# EAGLE design LowTemp_board_1 (EAGLE 6.4)
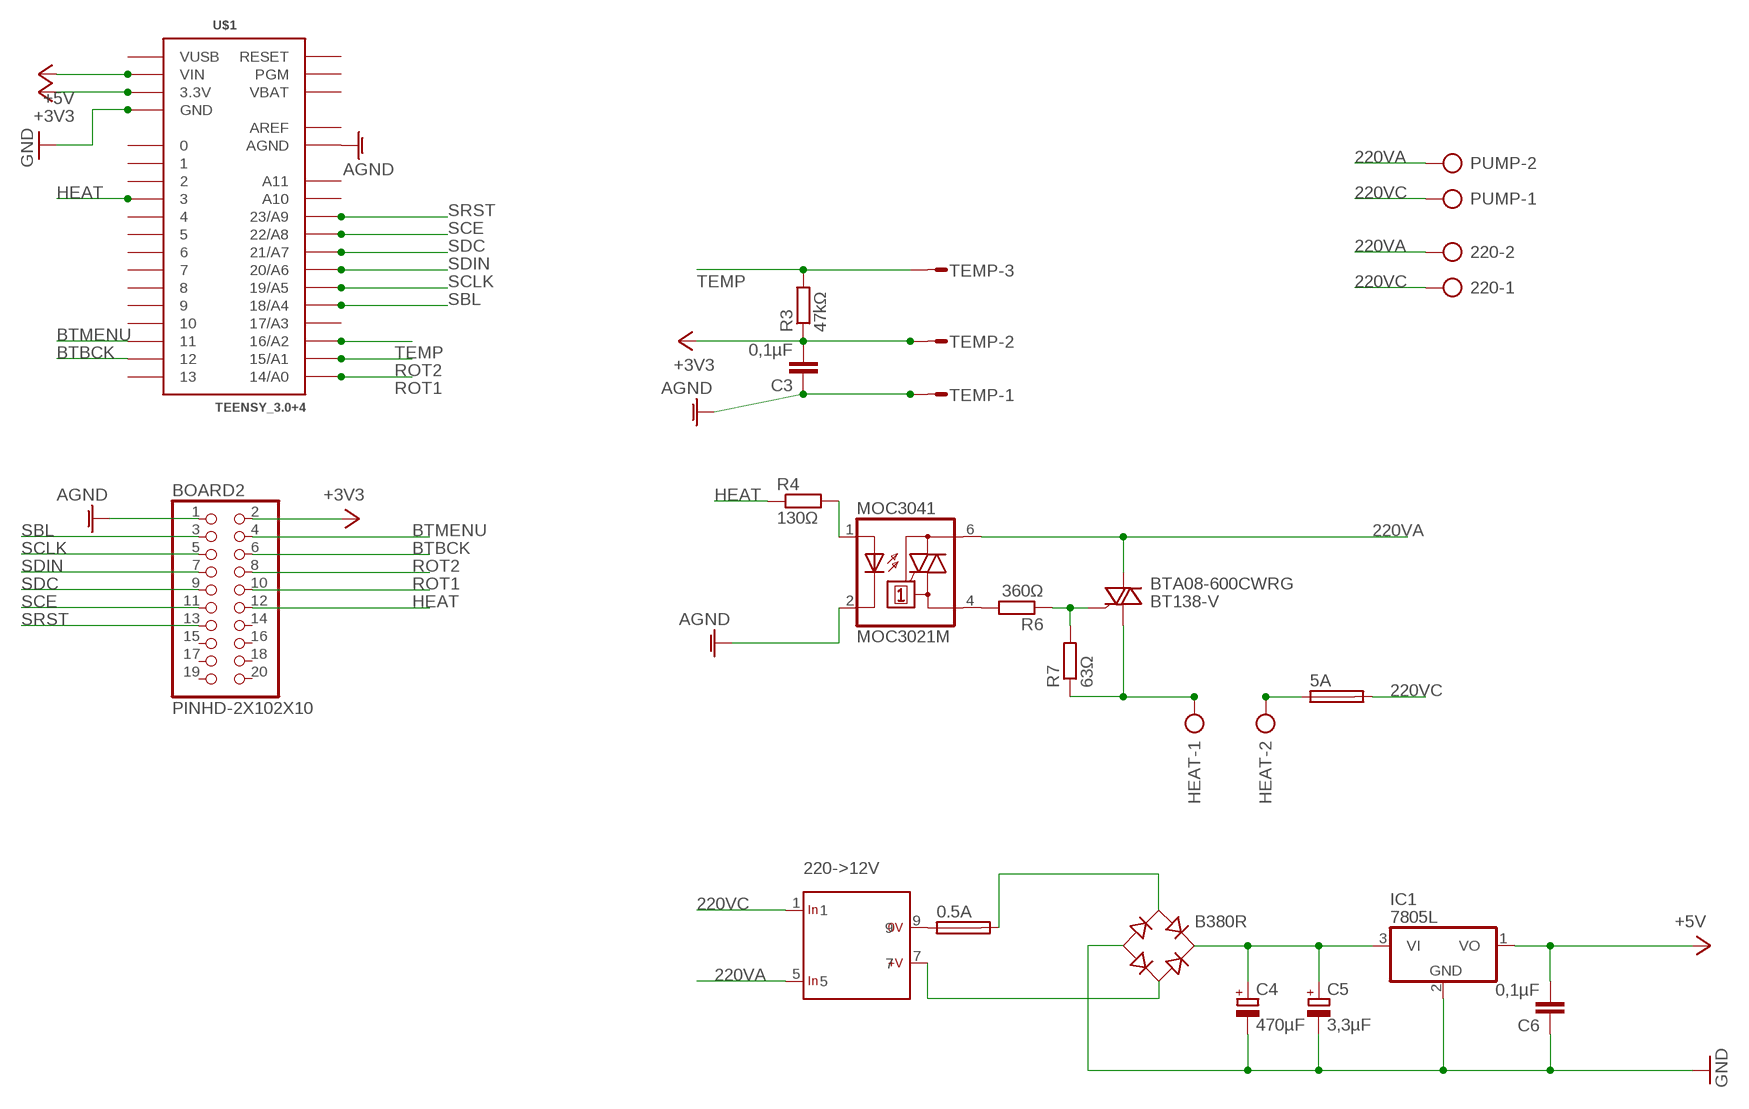
[diagram p0: schematic, sheet 1]

## Parts
0.5A  SH22,5A  [SH22,5A]
5A  SH22,5A  [SH22,5A]
220  AK500/2-H  [AK500/2-H]
220->12V  SINGLE  [1]
B380R  RB1A  [RB1A]
BOARD2  PINHD-2X102X10  [2X10]
BTA08-600CWRG  BT138-V  [TO220BV]
C3  0,1µF  C-EU050-025X075  [C050-025X075]
C4  470µF  CPOL-EUE5-8.5  [E5-8,5]
C5  3,3µF  CPOL-EUTT2D4  [TT2D4]
C6  0,1µF  C-EU050-025X075  [C050-025X075]
HEAT  AK500/2-H  [AK500/2-H]
IC1  7805L  [TO92]
MOC3041  MOC3021M  [DIL06]
PUMP  AK500/2-H  [AK500/2-H]
R3  47kΩ  R-EU_0207/7  [0207/7]
R4  130Ω  R-EU_0207/7  [0207/7]
R6  360Ω  R-EU_0207/7  [0207/7]
R7  63Ω  R-EU_0207/7  [0207/7]
TEMP  S03P  [S03P]
U$1  TEENSY_3.0+4  [TEENSY_3.0+4]

## Nets
220VA: 220->12V.5 220.2 BTA08-600CWRG.T2(A2) MOC3041.6(A2) PUMP.2
220VC: 5A.2 220->12V.1 220.1 PUMP.1
+3V3: BOARD2.2 C3.2 R3.1 TEMP.2 U$1.3.3V U$1.3.3V1(3.3V)
+5V: C6.2 IC1.1(VO) U$1.VIN
AGND: BOARD2.1 C3.1 MOC3041.2(C) TEMP.1 U$1.AGND
BTBCK: BOARD2.6 U$1.12
BTMENU: BOARD2.4 U$1.11
GND: B380R.- C4.- C5.- C6.1 IC1.2(GND) U$1.GND U$1.GND1(GND)
HEAT: BOARD2.12 R4.1 U$1.3
N$3: MOC3041.1(A) R4.2
N$5: MOC3041.4(A1) R6.2
N$6: BTA08-600CWRG.G R6.1 R7.2
N$7: 0.5A.1 220->12V.9
N$8: BTA08-600CWRG.T1(A1) HEAT.1 R7.1
N$9: 5A.1 HEAT.2
N$10: 220->12V.7 B380R.AC2
N$11: 0.5A.2 B380R.AC1
N$13: B380R.+ C4.+ C5.+ IC1.3(VI)
ROT1: BOARD2.10 U$1.14/A0
ROT2: BOARD2.8 U$1.15/A1
SBL: BOARD2.3 U$1.18/A4
SCE: BOARD2.11 U$1.22/A8
SCLK: BOARD2.5 U$1.19/A5
SDC: BOARD2.9 U$1.21/A7
SDIN: BOARD2.7 U$1.20/A6
SRST: BOARD2.13 U$1.23/A9
TEMP: R3.2 TEMP.3 U$1.16/A2
Unconnected: BOARD2.14 BOARD2.15 BOARD2.16 BOARD2.17 BOARD2.18 BOARD2.19 BOARD2.20 U$1.0 U$1.1 U$1.2 U$1.4 U$1.5 U$1.6 U$1.7 U$1.8 U$1.9 U$1.10 U$1.13 U$1.17/A3 U$1.A10 U$1.A11 U$1.PGM U$1.RESET

## Power pins joined to a net without a drawn wire
AREF: U$1.AREF
VBAT: U$1.VBAT
VUSB: U$1.VUSB

## Library data of the parts
0.5A 5A = fuse:SH22,5A: FUSE HOLDER grid 22,5mm, isolated cap OGN0031 8201, Schurter (Buerklin); MPN: 0031.7701.11; OC_FARNELL: unknown; OC_NEWARK: 04F1224
220 HEAT PUMP = con-ptr500:AK500/2-H: CONNECTOR Aug. 2004 / PTR Meßtechnik: Die Bezeichnung der Serie AK505 wurde geändert. Es handelt sich hierbei um AK500 in horizontaler Ausführung.; OC_FARNELL: unknown; OC_NEWARK: unknown
220->12V = myrra:SINGLE: One Output Input voltage range: 85 to 265 V AC or 85 to 370 V DC Input frequency: 47 to 440 Hz Output voltage accuracy (full load ): ± 2% Line output voltage variation: ± 0.3% Load output voltage variation: ± 0.5% Temperature range: -25 - TA (°C) No load input power: < 200mW regulated: Reference Output Current Power Efficiency Ta Volts mA Watts % °C 47121 3.3 750 2.5 65 +70 47122 5 550 2.75 68 +70 47123 9 270 2.5 72 +70 47124 12 210 2.5 74 +70 47125 15 170 2.5 75 +70 47126 24 110 2.5 77 +70 47151 3.3 1350 4.2 65 +50 47152 5 900 4.5 68 +50 47153 9 550 5 72 +50 47154 12 420 5 75 +50 47155 15 320 5 76 +50 47156 24 220 5 79 +50 non regulated: Reference Output Current Power Efficiency Ta Volts mA Watts % °C 47114 12 200 2.4 74 +70 47133 9 360 3.2 73 +70 47134 12 270 3.2 75 +70 47136 24 130 3.2 80 +70 47163 9 560 5* 73 +50 47164 12 420 5* 75 +50 47166 24 210 5* 80 +50 * Nota: Power up to 5.4W is possible with input voltage > 97 V AC Source: http://www.myrra.com
B380R = rectifier:RB1A: RECTIFIER 1 A
BOARD2 = adafruit:PINHD-2X10
BTA08-600CWRG = triac:BT138: TRIAC Source: http://www.semiconductors.philips.com BT138_SERIES_2.pdf
C3 C6 = resistor:C-EU: CAPACITOR, European symbol
C4 C5 = resistor:CPOL-EU: POLARIZED CAPACITOR, European symbol
IC1 = linear:78*: Positive VOLTAGE REGULATOR Source: http://cache.national.com/ds/LM/LM78L05.pdf http://www.fairchildsemi.com/ds/LM/LM7805.pdf
MOC3041 = optocoupler:MOC30*M: RANDOM-PHASE OPTOISOLATORS TRIAC DRIVER OUTPUT Source: http://www.fairchildsemi.com MOC3020-M.pdf; MF: FAIRCHILD SEMICONDUCTOR; MPN: MOC3021-M; OC_FARNELL: 1021365; OC_NEWARK: 95B7895
R3 R4 R6 R7 = resistor:R-EU_: RESISTOR, European symbol
TEMP = con-amp-mt:S03P: AMP MT CONNECTOR; OC_FARNELL: unknown; OC_NEWARK: unknown
U$1 = Teensy3.0:TEENSY_3.0+4: Teensy 3.0 board, showing all pins that are easily acessible. See 'AllAnalogPins" and 'AllPins' packages for additional pin holes, as needed. The 'Basic' package has fewer pins.

## Board
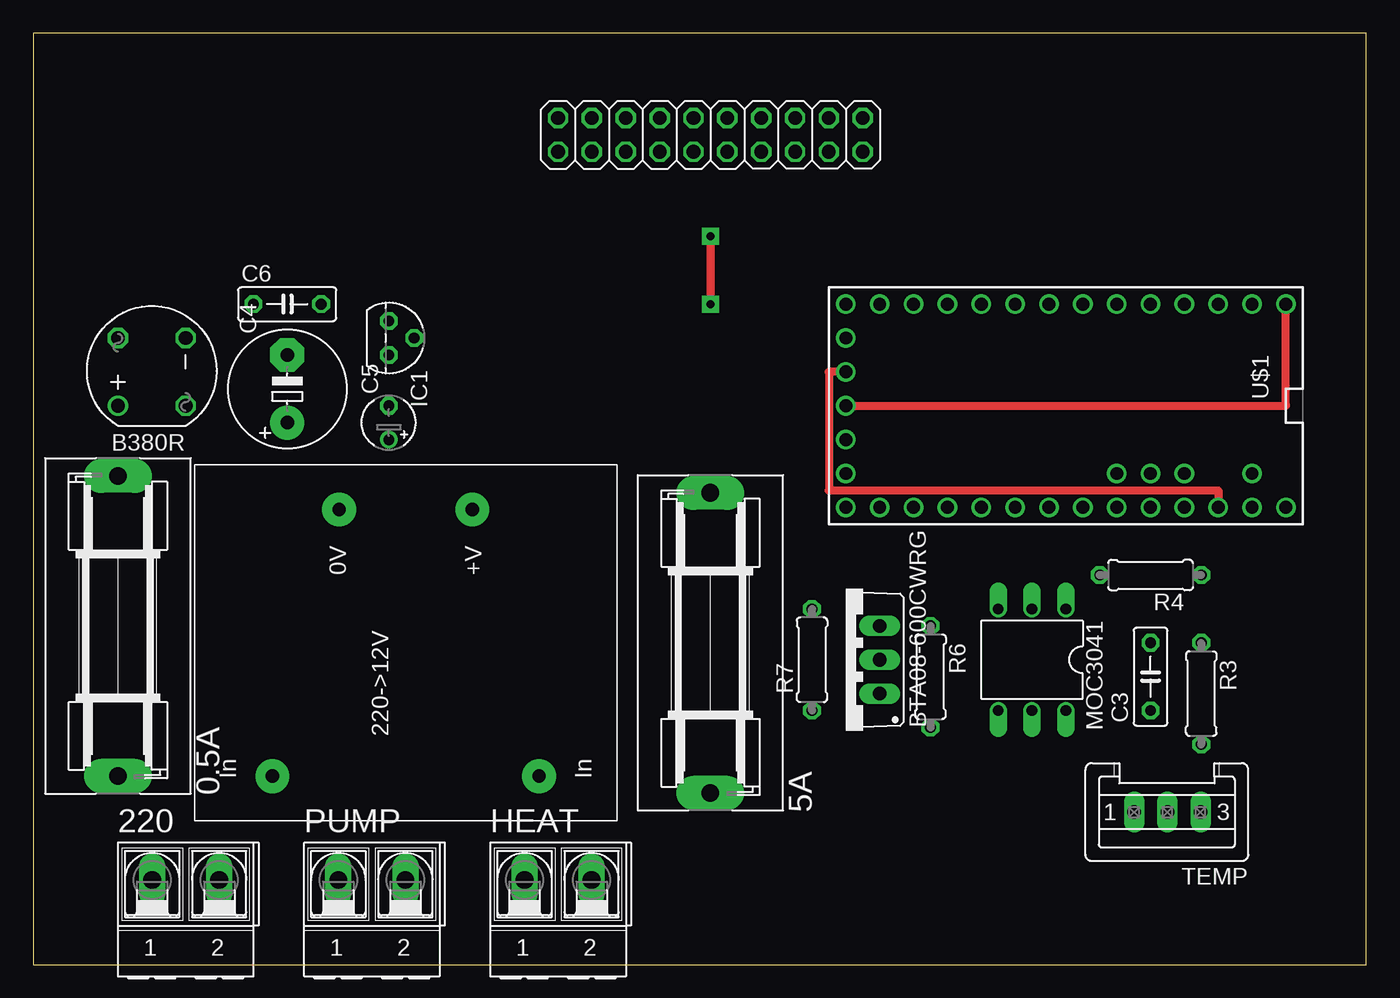
[diagram p1: board, top side]
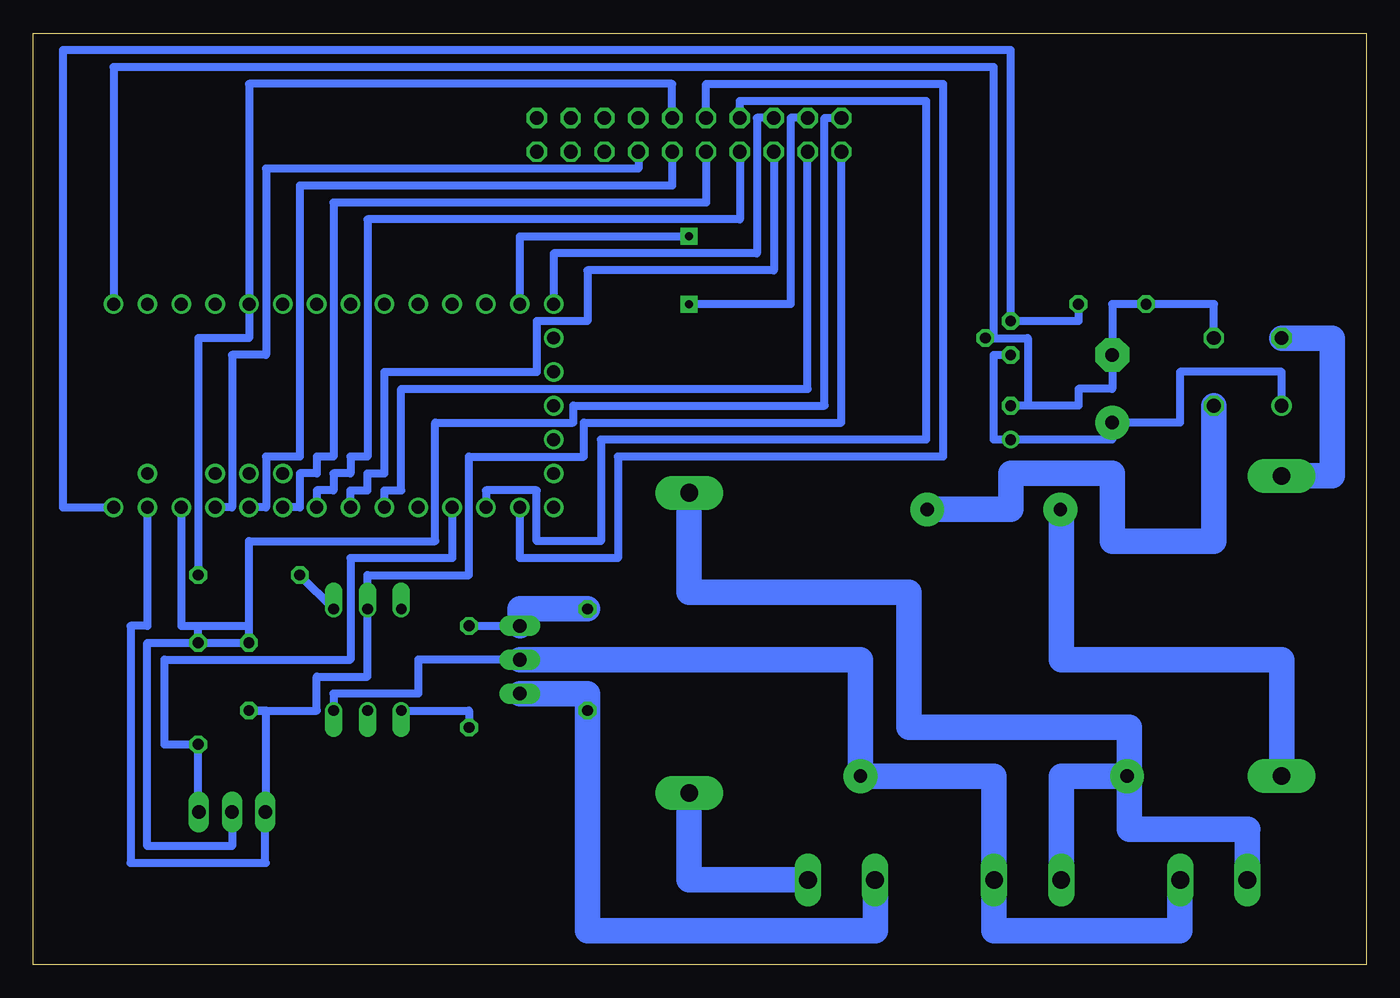
[diagram p2: board, bottom side, seen from below]

Size 100 x 69.84 mm. Coordinates in mm from the lower left corner, seen from the top.
Outline: 0,0 100,0 100,69.84 0,69.84 0,0
Copper layers (1*16): Top 0.035mm / dielectric 1.5mm / Bottom 0.035mm
Design rules "default": minimum track width 10mil, minimum drill 24mil, track to track 8mil, track to pad 8mil, pad to pad 8mil, via to via 8mil, smd to smd 8mil, copper to edge 40mil, drill to drill 8mil, minimum pad ring 10mil, minimum via ring 8mil, stop-mask expansion 4mil, vias tented up to drill 0mil, thermal gap 10mil

### Footprints (pad centres in the part's own frame; a part is rotated, then mirrored left to right if it is on the bottom)
SH22,5A = drill 1.321 pad 2.54 long: 1 -11.252,0; 2 11.252,0
AK500/2-H = drill 1.321 long: 1 -2.515,0; 2 2.515,0
1 = drill 1 pad 2.54: 1 -10,10; 5 -10,-10; 7 10,-5; 9 10,5
RB1A = drill 1.016: + -2.54,2.54 | drill 1.016 octagon: - 2.54,-2.54; AC1 2.54,2.54; AC2 -2.54,-2.54
2X10 = drill 1.016 octagon: 1 -11.43,-1.27; 2 -11.43,1.27; 3 -8.89,-1.27; 4 -8.89,1.27; 5 -6.35,-1.27; 6 -6.35,1.27; 7 -3.81,-1.27; 8 -3.81,1.27; 9 -1.27,-1.27; 10 -1.27,1.27; 11 1.27,-1.27; 12 1.27,1.27; 13 3.81,-1.27; 14 3.81,1.27; 15 6.35,-1.27; 16 6.35,1.27; 17 8.89,-1.27; 18 8.89,1.27; 19 11.43,-1.27; 20 11.43,1.27
TO220BV = drill 1.016 long: G 2.54,-2.54; T1 -2.54,-2.54; T2 0,-2.54
C050-025X075 = drill 0.813 octagon: 1 -2.54,0; 2 2.54,0
E5-8,5 = drill 1.016 pad 2.54: + -2.54,0 | drill 1.016 pad 2.54 octagon: - 2.54,0
TT2D4 = drill 0.813: + -1.27,0 | drill 0.813 octagon: - 1.27,0
TO92 = drill 0.813 octagon: 1 -1.27,0; 2 0,1.905; 3 1.27,0
DIL06 = drill 0.813 offset: 1 -2.54,-3.81; 2 0,-3.81; 3 2.54,-3.81; 4 2.54,3.81; 5 0,3.81; 6 -2.54,3.81
0207/7 = drill 0.813 octagon: 1 -3.81,0; 2 3.81,0
S03P = drill 1.016 long: 1 2.5,0; 2 0,0; 3 -2.5,0
TEENSY_3.0+4 = drill 0.965: 0 -7.62,13.97; 1 -7.62,11.43; 2 -7.62,8.89; 3 -7.62,6.35; 3.3V 7.62,11.43; 3.3V1 -2.54,-16.51; 4 -7.62,3.81; 5 -7.62,1.27; 6 -7.62,-1.27; 7 -7.62,-3.81; 8 -7.62,-6.35; 9 -7.62,-8.89; 10 -7.62,-11.43; 11 -7.62,-13.97; 12 -7.62,-16.51; 13 7.62,-16.51; 14/A0 7.62,-13.97; 15/A1 7.62,-11.43; 16/A2 7.62,-8.89; 17/A3 7.62,-6.35; 18/A4 7.62,-3.81; 19/A5 7.62,-1.27; 20/A6 7.62,1.27; 21/A7 7.62,3.81; 22/A8 7.62,6.35; 23/A9 7.62,8.89; A10 5.08,6.35; A11 5.08,3.81; AGND 7.62,13.97; AREF 5.08,8.89; GND -7.62,16.51; GND1 0,-16.51; PGM 2.54,-16.51; RESET 5.08,-16.51; VBAT -5.08,-16.51; VIN 7.62,16.51; VUSB 5.08,13.97

### Placement (x,y rotation side)
0.5A  6.35,25.4 90 top
5A  50.8,24.13 90 top
220  11.43,6.35 0 top
220->12V  27.94,24.13 90 top
B380R  8.89,44.45 90 top
BOARD2  50.8,62.23 0 top
BTA08-600CWRG  60.96,22.86 90 top
C3  83.82,21.59 90 top
C4  19.05,43.18 90 top
C5  26.67,40.64 90 top
C6  19.05,49.53 0 top
HEAT  39.37,6.35 0 top
IC1  26.67,46.99 270 top
MOC3041  74.93,22.86 180 top
PUMP  25.4,6.35 0 top
R3  87.63,20.32 270 top
R4  83.82,29.21 180 top
R6  67.31,21.59 270 top
R7  58.42,22.86 90 top
TEMP  85.09,11.43 180 top
U$1  77.47,41.91 270 top

### Tracks (layer width: path | path; a pad name or v marks a point on that pad's centre or on a via)
220VA
  Bottom 0.61: BTA08-600CWRG.T2 71.12,22.86 71.12,20.32 77.47,20.32 MOC3041.6
  Bottom 1.93: 220.2 13.97,6.35 13.97,2.54 27.91,2.54 | 27.94,2.54 27.91,2.54 | 27.91,2.54 PUMP.2 27.91,14.13 220->12V.5 37.94,22.86 BTA08-600CWRG.T2
220VC
  Bottom 1.93: PUMP.1 22.89,14.13 220->12V.1 17.78,14.13 | 17.78,14.13 17.78,17.78 34.29,17.78 34.29,27.94 50.8,27.94 5A.2 | 17.78,14.13 17.78,10.16 8.91,10.16 | 8.89,10.16 8.91,10.16 | 8.91,10.16 220.1
+3V3
  Top 0.61: U$1.3.3V1 59.69,44.45 59.69,35.56 88.9,35.56 U$1.3.3V
  Bottom 0.61: U$1.3.3V 88.9,25.4 87.63,25.4 | 87.63,25.4 83.82,25.4 | 83.82,25.4 83.82,31.75 69.85,31.75 69.85,40.64 59.5,40.64 59.5,41.91 40.64,41.91 40.64,63.5 BOARD2.2 | R3.1 C3.2 83.82,25.4 | R3.1 87.63,25.4 | TEMP.2 85.09,8.89 91.44,8.89 91.44,24.13 R3.1
+5V
  Bottom 0.61: C6.2 21.59,48.26 IC1.1 26.67,68.58 97.79,68.58 97.79,34.29 U$1.VIN
AGND
  Bottom 0.61: U$1.AGND 91.44,25.4 92.71,25.4 92.71,7.62 82.59,7.62 | 82.55,7.62 82.59,7.62 | 82.59,7.62 TEMP.1 82.55,11.43 82.55,19.05 C3.1 78.74,19.05 78.74,21.59 74.93,21.59 MOC3041.2 74.93,29.21 67.31,29.21 67.31,38.1 58.69,38.1 58.69,40.64 39.37,40.64 BOARD2.1
BTBCK
  Bottom 0.61: BOARD2.6 45.72,63.5 45.72,53.34 60.96,53.34 U$1.12
BTMENU  (via drill 0.6 pad 1.27)
  Top 0.61: v50.8,54.61 v50.8,49.53
  Bottom 0.61: BOARD2.4 43.18,63.5 43.18,49.53 v50.8,49.53 | U$1.11 63.5,54.61 v50.8,54.61
GND
  Top 0.61: U$1.GND1 93.98,41.91 U$1.GND
  Bottom 0.61: B380R.- 11.43,49.53 C6.1 19.05,49.53 C4.- 19.05,43.18 21.59,43.18 21.59,41.91 25.4,41.91 | 25.4,41.91 C5.- | 25.4,41.91 25.4,46.99 IC1.2 27.94,46.99 27.94,67.31 93.98,67.31 U$1.GND
HEAT
  Bottom 0.61: BOARD2.12 52.07,66.04 83.82,66.04 U$1.3 83.82,46.99 87.63,46.99 R4.1
N$3
  Bottom 0.61: R4.2 MOC3041.1
N$5
  Bottom 0.61: MOC3041.4 67.31,19.05 R6.2
N$6
  Bottom 0.61: R6.1 BTA08-600CWRG.G
  Bottom 1.93: BTA08-600CWRG.G 63.5,26.67 R7.2
N$7
  Bottom 1.93: 220->12V.9 22.86,34.13 22.86,22.86 6.35,22.86 0.5A.1
N$8
  Bottom 1.93: HEAT.1 36.83,6.35 36.83,2.54 58.42,2.54 R7.1 58.42,20.32 BTA08-600CWRG.T1
N$9
  Bottom 1.93: HEAT.2 50.8,6.35 5A.1
N$10
  Bottom 1.93: 220->12V.7 26.67,34.13 26.67,36.83 19.05,36.83 19.05,31.75 11.43,31.75 B380R.AC2
N$11
  Bottom 1.93: 0.5A.2 2.54,36.65 2.54,46.99 B380R.AC1
N$13
  Bottom 0.61: B380R.+ 6.35,44.45 13.97,44.45 13.97,40.64 C4.+ 19.05,39.37 C5.+ 27.94,39.37 27.94,45.72 IC1.3
ROT1
  Bottom 0.61: BOARD2.10 49.53,66.04 31.75,66.04 31.75,38.1 56.15,38.1 56.15,30.48 63.5,30.48 U$1.14/A0
ROT2
  Bottom 0.61: BOARD2.8 46.99,64.77 33.02,64.77 33.02,39.37 57.42,39.37 57.42,31.75 62.23,31.75 62.23,35.56 66.04,35.56 U$1.15/A1
SBL
  Bottom 0.61: U$1.18/A4 73.66,35.56 72.39,35.56 72.39,43.18 41.91,43.18 BOARD2.3
SCE
  Bottom 0.61: BOARD2.11 52.07,58.42 80.01,58.42 80.01,38.1 82.55,38.1 82.55,34.29 U$1.22/A8
SCLK
  Bottom 0.61: BOARD2.5 44.45,52.07 58.42,52.07 58.42,48.26 62.23,48.26 62.23,44.45 73.66,44.45 73.66,36.83 74.93,36.83 74.93,35.56 76.2,35.56 U$1.19/A5
SDC
  Bottom 0.61: BOARD2.9 49.53,57.15 77.47,57.15 77.47,38.1 78.74,38.1 78.74,36.83 80.01,36.83 80.01,34.29 U$1.21/A7
SDIN
  Bottom 0.61: BOARD2.7 46.99,55.88 74.93,55.88 74.93,38.1 76.2,38.1 76.2,36.83 77.47,36.83 77.47,35.56 78.74,35.56 U$1.20/A6
SRST
  Bottom 0.61: BOARD2.13 54.61,59.69 82.55,59.69 82.55,45.72 85.09,45.72 85.09,34.29 U$1.23/A9
TEMP
  Bottom 0.61: U$1.16/A2 68.58,30.48 76.2,30.48 76.2,22.86 90.17,22.86 90.17,16.51 R3.2 87.63,11.43 TEMP.3